# EAGLE design OpenSnake (EAGLE 9.6.2)
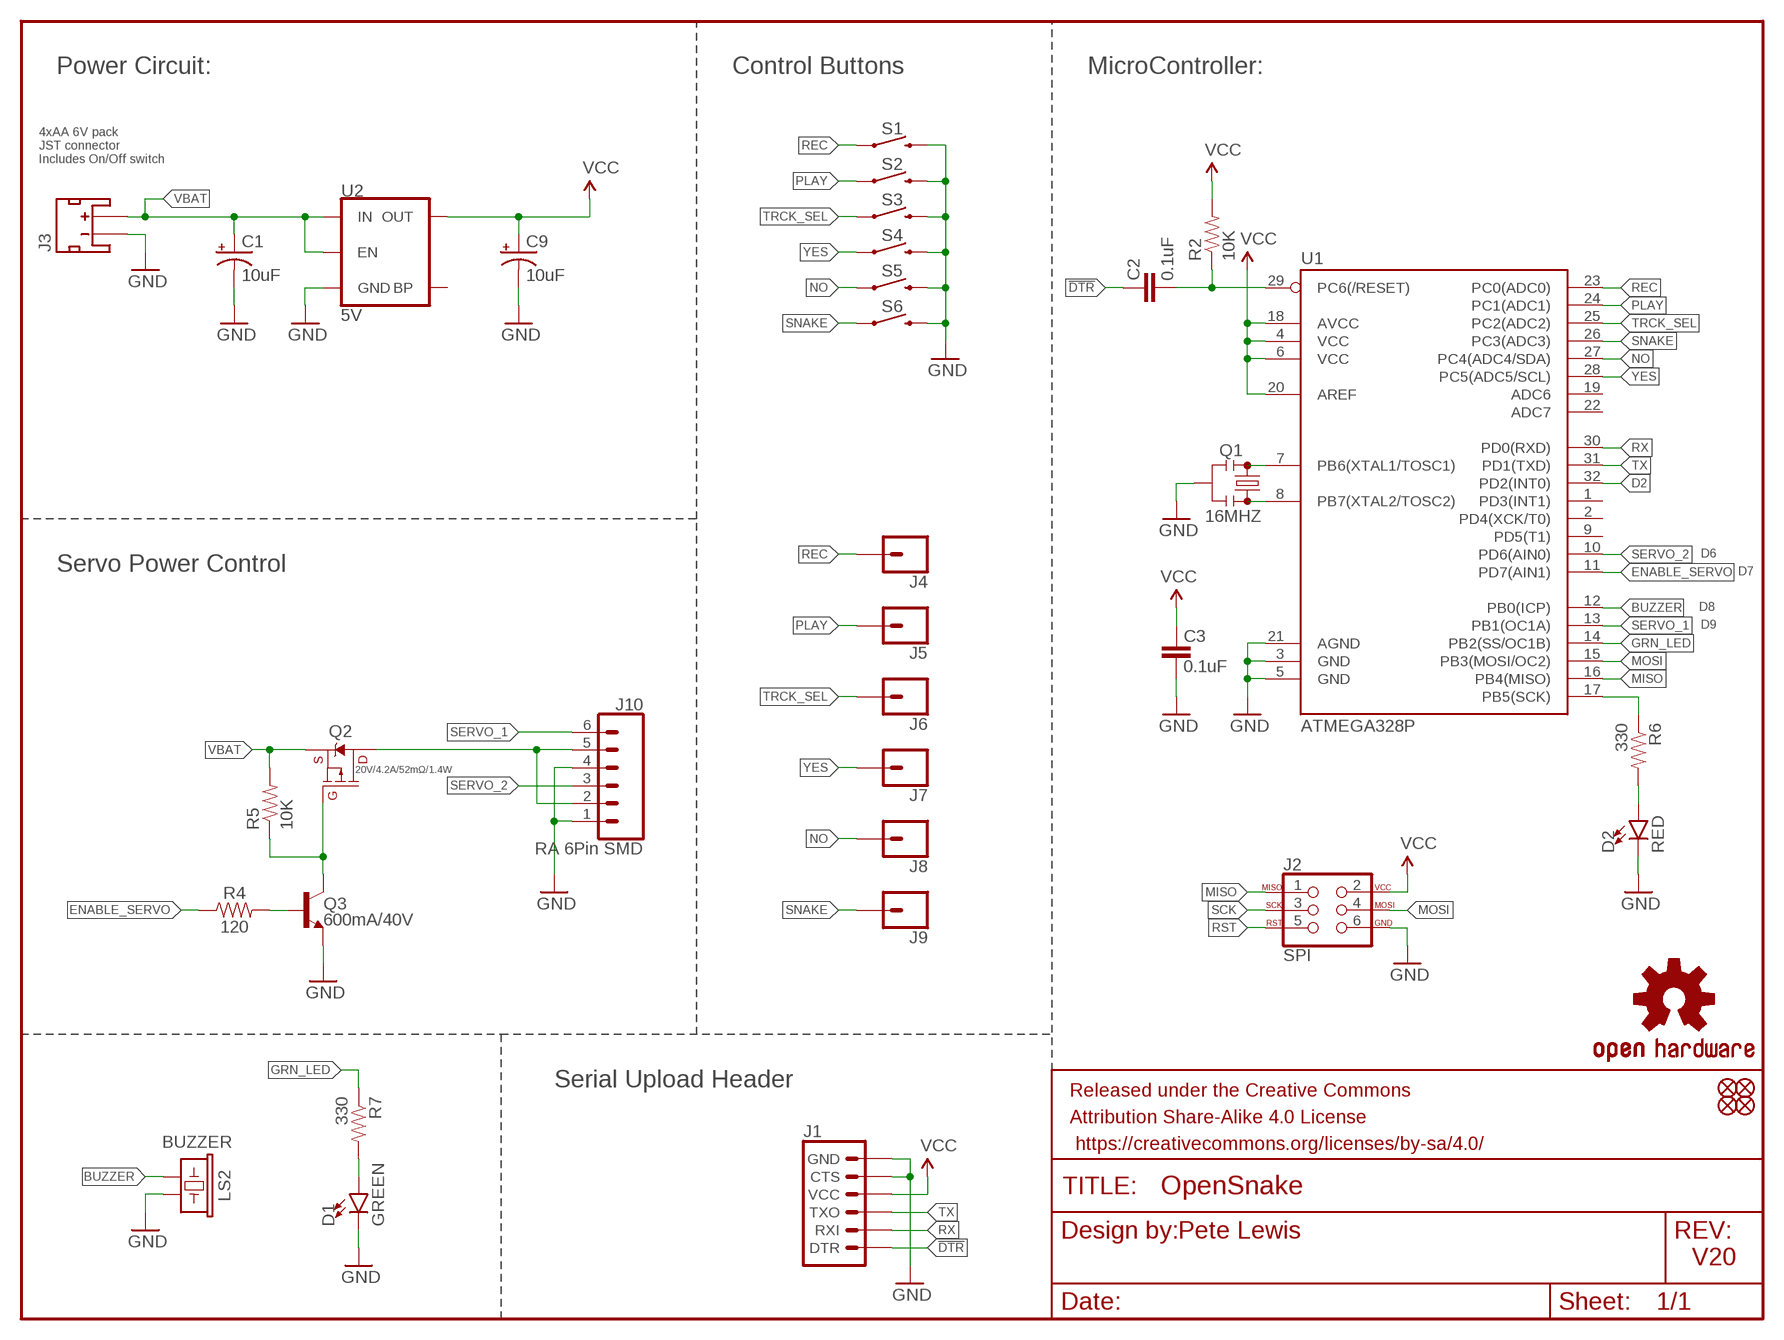
[diagram p0: schematic, sheet 1]

## Parts
C1  10uF  10UF-POLAR-EIA3216-16V-10%(TANT)  [EIA3216]
C2  0.1uF  0.1UF-25V(+80/-20%)(0603)  [0603-CAP]
C3  0.1uF  0.1UF-25V(+80/-20%)(0603)  [0603-CAP]
C9  10uF  10UF-POLAR-EIA3216-16V-10%(TANT)  [EIA3216]
D1  GREEN  LED-GREEN1206  [LED-1206]
D2  RED  LED-RED1206  [LED-1206]
FD1  FIDUCIALUFIDUCIAL  [FIDUCIAL-MICRO]
FD2  FIDUCIALUFIDUCIAL  [FIDUCIAL-MICRO]
FD3  FIDUCIALUFIDUCIAL  [FIDUCIAL-MICRO]
FD4  FIDUCIALUFIDUCIAL  [FIDUCIAL-MICRO]
FRAME1  FRAME-LETTER  [CREATIVE_COMMONS]
J1  6_PIN_SERIAL_TARGETSILK  [6_PIN_SERIAL_TARGET_SIDE_W_SILK]
J2  SPI  AVR_SPI_PROG_3X2TESTPOINTS  [2X3_TEST_POINTS]
J3  JST_2MM_MALE  [JST-2-SMD]
J4  CONN_01PTH_NO_SILK_YES_STOP  [1X01_NO_SILK]
J5  CONN_01PTH_NO_SILK_YES_STOP  [1X01_NO_SILK]
J6  CONN_01PTH_NO_SILK_YES_STOP  [1X01_NO_SILK]
J7  CONN_01PTH_NO_SILK_YES_STOP  [1X01_NO_SILK]
J8  CONN_01PTH_NO_SILK_YES_STOP  [1X01_NO_SILK]
J9  CONN_01PTH_NO_SILK_YES_STOP  [1X01_NO_SILK]
J10  RA 6Pin SMD  CONN_06SMD  [1X06-SMD_RA_MALE]
LOGO1  OSHW-LOGOL  [OSHW-LOGO-L]
LS2  BUZZER  BUZZER-SMD  [BUZZER-CCV]
Q1  16MHZ  RESONATOR16MHZ  [RESONATOR-SMD]
Q2  20V/4.2A/52mΩ/1.4W  MOSFET_PCH-DMG2305UX-7  [SOT23-3]
Q3  600mA/40V  TRANS_NPN-MMBT2222AL  [SOT23-3]
R2  10K  10KOHM-1/10W-1%(0603)0603  [0603-RES]
R4  120  100OHM-0603-1/10W-1%  [0603]
R5  10K  10KOHM-1/10W-1%(0603)0603  [0603-RES]
R6  330  330OHM1/10W1%(0603)  [0603-RES]
R7  330  330OHM1/10W1%(0603)  [0603-RES]
S1  MOMENTARY-SWITCH-SPST-SMD-5.2MM-TALL  [TACTILE_SWITCH_SMD_5.2MM]
S2  MOMENTARY-SWITCH-SPST-SMD-5.2MM-TALL  [TACTILE_SWITCH_SMD_5.2MM]
S3  MOMENTARY-SWITCH-SPST-SMD-5.2MM-TALL  [TACTILE_SWITCH_SMD_5.2MM]
S4  MOMENTARY-SWITCH-SPST-SMD-5.2MM-TALL  [TACTILE_SWITCH_SMD_5.2MM]
S5  MOMENTARY-SWITCH-SPST-SMD-5.2MM-TALL  [TACTILE_SWITCH_SMD_5.2MM]
S6  MOMENTARY-SWITCH-SPST-SMD-5.2MM-TALL  [TACTILE_SWITCH_SMD_5.2MM]
U1  ATMEGA328P  ATMEGA328P_TQFP  [TQFP32-08]
U2  5V  V_REG_MIC52055V  [SOT23-5]

## Nets
!DTR: C2.2 J1.P$1(DTR)
BUZZER: LS2.- U1.12(PB0(ICP))
D2: U1.32(PD2(INT0))
ENABLE_SERVO: R4.1 U1.11(PD7(AIN1))
GND [vcc]: C1.- C3.1 C9.- D1.C D2.C J1.P$5(CTS) J1.P$6(GND) J2.6 J3.1(-) J10.1 J10.4 LS2.+ Q1.2 Q3.2(E) S1.3 S2.3 S3.3 S4.3 S5.3 S6.3 U1.3(GND) U1.5(GND) U1.21(AGND) U2.2(GND)
GRN_LED: R7.1 U1.14(PB2(SS/OC1B))
MISO: J2.1 U1.16(PB4(MISO))
MOSI: J2.4 U1.15(PB3(MOSI/OC2))
N$1: Q1.1 U1.8(PB7(XTAL2/TOSC2))
N$2: Q1.3 U1.7(PB6(XTAL1/TOSC1))
N$4: Q3.1(B) R4.2
N$5: Q2.1(G) Q3.3(C) R5.1
N$6: J10.2 J10.5 Q2.3(D)
N$7: D2.A R6.2
N$10: D1.A R7.2
NO: J8.1 S5.1 U1.27(PC4(ADC4/SDA))
PLAY: J5.1 S2.1 U1.24(PC1(ADC1))
REC: J4.1 S1.1 U1.23(PC0(ADC0))
RST: C2.1 J2.5 R2.1 U1.29(PC6(/RESET))
RX: J1.P$3(RXI) U1.30(PD0(RXD))
SCK: J2.3 R6.1 U1.17(PB5(SCK))
SERVO_1: J10.6 U1.13(PB1(OC1A))
SERVO_2: J10.3 U1.10(PD6(AIN0))
SNAKE: J9.1 S6.1 U1.26(PC3(ADC3))
TRCK_SEL: J6.1 S3.1 U1.25(PC2(ADC2))
TX: J1.P$2(TXO) U1.31(PD1(TXD))
VBAT: C1.+ J3.2(+) Q2.2(S) R5.2 U2.1(IN) U2.3(EN)
VCC: C3.2 C9.+ J1.P$4(VCC) J2.2 R2.2 U1.4(VCC) U1.6(VCC) U1.18(AVCC) U1.20(AREF) U2.5(OUT)
YES: J7.1 S4.1 U1.28(PC5(ADC5/SCL))
Unconnected: J3.NC1(PAD1) J3.NC2(PAD2) U1.1(PD3(INT1)) U1.2(PD4(XCK/T0)) U1.9(PD5(T1)) U1.19(ADC6) U1.22(ADC7) U2.4(BP)

## Notes on the sheet
- Power Circuit: | Control Buttons | MicroController:
- 4xAA 6V pack
  JST connector
  Includes On/Off switch
- D6
- Servo Power Control
- D7
- D8
- D9
- Serial Upload Header
- Pete Lewis
- V20

## Library data of the parts
C1 C9 = SparkFun-Capacitors:10UF-POLAR: 10.0µF polarized capacitors A capacitor is a passive two-terminal electrical component used to store electrical energy temporarily in an electric field.; PROD_ID: CAP-00811
C2 C3 = SparkFun-Capacitors:0.1UF-25V(+80/-20%)(0603): CAP-00810 Ceramic Standard decoupling cap; PROD_ID: CAP-00810
D1 = SparkFun-LED:LED-GREEN: Green SMD LED Used in manufacturing of various products at SparkFun Packages: 0603 - SMD 0603 package [Product Link] <http://www.futureelectronics.com/en/technologies/semiconductors/optoelectronics/leds/Pages/9894312-LTST-C190GKT.aspx?CrossPart=HSMG-C190&IM=0> LilyPad 1206 - SMD1206 LilyPad package [Product Link] <http://www.futureelectronics.com/en/Technologies/Product.aspx?ProductID=IN150NGHARVATEKCORPORATION2049943&IM=0> 1206 - SMD1206 package [Product Link] <http://www.futureelectronics.com/en/technologies/semiconductors/optoelectronics/leds/Pages/8315665-LTST-C150KGKT.aspx?IM=0> 1206 Bottom Mount -SMD 1206 Bottom Mount [Product Link] <http://www.digikey.com/product-detail/en/lite-on-inc/LTST-C230KGKT/160-1456-1-ND/386854> SparkFun Products: Pro Mini 328 -5V <https://www.sparkfun.com/products/821> RedBoard <https://www.sparkfun.com/products/12757> MP3 Trigger <https://www.sparkfun.com/products/13720> Makey Makey <https://www.sparkfun.com/products/11076>; PROD_ID: DIO-00862
D2 = SparkFun-LED:LED-RED: Red SMD LED Used in manufacturing of most products at SparkFun Packages: 0603 - SMD 0603 package [Product Link] <http://docs.avagotech.com/docs/AV02-0551EN> 0603 SMART - SMD 0603 SMART package ( more efficient and expensive)[Product Link] <http://www.osram-os.com/Graphics/XPic2/00077099_0.pdf> 1206 - SMD1206 package [Product Link] <https://www.sparkfun.com/datasheets/DevTools/LilyPad/Q150OVS4.pdff> SparkFun Products: Pro Mini 328 -5V <https://www.sparkfun.com/products/821> RedBoard <https://www.sparkfun.com/products/12757> IOIO-OTG <https://www.sparkfun.com/products/13613>; PROD_ID: DIO-09912
FD1-FD4 = SparkFun-Aesthetics:FIDUCIAL: Fiducial Alignment Points Point-of-reference for pick-and-place machines and other optical instruments.
FRAME1 = SparkFun-Aesthetics:FRAME-LETTER: Schematic Frame - Letter Standard 8.5x11 US Letter frame
J1 = SparkFun-Connectors:6_PIN_SERIAL_TARGET: 6-pin header connection for use with the "FTDI BASIC" pinout - TARGET SIDE. Also known as "Arduino Serial Program Header". It is used to mate with our FTDI Basic serial programmers using the Arduino IDE. Note, this device has "TARGET" in the name. It is intended to be used on a design that contains a target micro-controller that you wish to program. The "sister" device, named "CABLE" is inteneded to be used on a design that usually lives on the end of your USB cable and prvides the converter chip (FTDI232 or FTDI231x) to commnicate serial RX/TX. You can populate with some of these: Break Away Headers - Straight <https://www.sparkfun.com/products/116> (PRT-00116) For reference (or to suit your programming needs) check out these designs: SparkFun FTDI Basic Breakout - 5V <https://www.sparkfun.com/products/9716> (DEV-09716) SparkFun FTDI Basic Breakout - 3.3V <https://www.sparkfun.com/products/9873> (DEV-09873) SparkFun FTDI SmartBasic <https://www.sparkfun.com/products/12935> (DEV-12935) SparkFun Beefy 3 - FTDI Basic Breakout <https://www.sparkfun.com/products/13746> (DEV-13746)
J2 = SparkFun-Connectors:AVR_SPI_PROG_3X2: AVR ISP 6 Pin This is the reduced ISP connector for AVR programming. Common on Arduino. This footprint will take up less PCB space and can be used with a 10-pin to 6-pin adapter such as SKU: BOB-08508 **Special note about "TEST_POINT" package. The stop mask is on the top side, so if you want your programming test points to be on the bottom of your board, make sure to place this package on the bottom side of the board. This also ensure that the orientation to program from the bottom side will be correct. SparkFun Products: SparkFun ISP Pogo Adapter <https://www.sparkfun.com/products/11591> - NS Tiny AVR Programmer <https://www.sparkfun.com/products/11801> -PTH
J3 = SparkFun-Connectors:JST_2MM_MALE: JST 2MM MALE RA CONNECTOR Two pin, compact surface mount connector. Commonly used as a battery input connection point. We really like the solid locking feeling and high current rating on these small connectors. We use these all the time as battery connectors. Mates to single-cell LiPo batteries. Here is the connector we sell at SparkFun: JST Right Angle Connector - White <https://www.sparkfun.com/products/8612> (PRT-08612) Datasheet <http://www.sparkfun.com/datasheets/Prototyping/Connectors/JST-Horizontal.pdf> It was used on these SparkFun products: SparkFun MOSFET Power Controller <https://www.sparkfun.com/products/11214> (PRT-11214) SparkFun Battery Babysitter - LiPo Battery Manager <https://www.sparkfun.com/products/13777> (PRT-13777) And many, many others that required a lipo battery connection.; PROD_ID: CONN-11443; SF_ID: PRT-08612
J4-J9 = SparkFun-Connectors:CONN_01: Single connection point. Often used as Generic Header-pin footprint for 0.1 inch spaced/style header connections On any of the 0.1 inch spaced packages, you can populate with these: Break Away Headers - Straight <https://www.sparkfun.com/products/116> (PRT-00116) Break Away Male Headers - Right Angle <https://www.sparkfun.com/products/553> (PRT-00553) Female Headers <https://www.sparkfun.com/products/115> (PRT-00115) Break Away Headers - Machine Pin <https://www.sparkfun.com/products/117> (PRT-00117) Break Away Female Headers - Swiss Machine Pin <https://www.sparkfun.com/products/743> (PRT-00743) This device is also useful as a general connection point to wire up your design to another part of your project. Our various solder wires solder well into these plated through hole pads. Hook-Up Wire - Assortment (Stranded, 22 AWG) <https://www.sparkfun.com/products/11375> (PRT-11375) Hook-Up Wire - Assortment (Solid Core, 22 AWG) <https://www.sparkfun.com/products/11367> (PRT-11367) View the entire wire category on our website here <https://www.sparkfun.com/categories/141> Special notes: SMTSO-256-ET is a "flush mount" nut for a 4-40 screw. We mostly use this on specialty testbeds; it is a nice way to connect hardware to your PCB at an adjustable hieght. Also note, the SNAP packages are for using a snappable style connector. We sell a baggie of snaps and they are also used on two LilyPad designs: Snap Assortment - 30 pack (male and female) <https://www.sparkfun.com/products/11347> (DEV-11347) LilyPad Arduino SimpleSnap <https://www.sparkfun.com/products/10941> (DEV-10941) LilyPad SimpleSnap Protoboard <https://www.sparkfun.com/products/10940> (DEV-10940)
J10 = SparkFun-Connectors:CONN_06: Multi connection point. Often used as Generic Header-pin footprint for 0.1 inch spaced/style header connections On any of the 0.1 inch spaced packages, you can populate with these: Break Away Headers - Straight <https://www.sparkfun.com/products/116> (PRT-00116) Break Away Male Headers - Right Angle <https://www.sparkfun.com/products/553> (PRT-00553) Female Headers <https://www.sparkfun.com/products/115> (PRT-00115) Break Away Headers - Machine Pin <https://www.sparkfun.com/products/117> (PRT-00117) Break Away Female Headers - Swiss Machine Pin <https://www.sparkfun.com/products/743> (PRT-00743) Arduino Stackable Header - 6 Pin <https://www.sparkfun.com/products/9280> (PRT-09280) For SCREWTERMINALS and SPRING TERMINALS visit here: Screw Terimnals on SparkFun.com <https://www.sparkfun.com/search/results?term=Screw+Terminals> (5mm/3.5mm/2.54mm spacing) This device is also useful as a general connection point to wire up your design to another part of your project. Our various solder wires solder well into these plated through hole pads. Hook-Up Wire - Assortment (Stranded, 22 AWG) <https://www.sparkfun.com/products/11375> (PRT-11375) Hook-Up Wire - Assortment (Solid Core, 22 AWG) <https://www.sparkfun.com/products/11367> (PRT-11367) View the entire wire category on our website here <https://www.sparkfun.com/categories/141>; PROD_ID: CONN-08971
LOGO1 = SparkFun-Aesthetics:OSHW-LOGO: Open-Source Hardware (OSHW) Logo This logo indicates the piece of hardware it is found on incorporates a OSHW license and/or adheres to the definition of open source hardware found here: http://freedomdefined.org/OSHW
LS2 = SparkFun-Electromechanical:BUZZER: Buzzer Small round buzzers that operate around the audible 2kHz range. You can use these as speakers to create simple music or user interfaces. Variant Overview: PTH - Mini Speaker - PC Mount 12mm 2.048kHz <https://www.sparkfun.com/products/7950> PTH_KIT - Mini Speaker - PC Mount 12mm 2.048kHz <https://www.sparkfun.com/products/7950> KIT simplifies soldering by adding stop mask to one side of the pads. PTH_NO_SILK - Mini Speaker - PC Mount 12mm 2.048kHz <https://www.sparkfun.com/products/7950> No silkscreen indicator of buzzer outline. PTH_KIT_NO_SILK - Mini Speaker - PC Mount 12mm 2.048kHz <https://www.sparkfun.com/products/7950> KIT package w/o silkscreen SMD - Buzzer Audio Magnetic (CCV-084B16) SMD buzzer used on, e.g. the LilyPad Buzzer <https://www.sparkfun.com/products/8463> and RFID USB Reader <https://www.sparkfun.com/products/9963>. SMD_KIT - Buzzer Audio Magnetic (CCV-084B16) SMD Buzzer with elongated pins to make soldering easier. Used on the SparkFun Simon Says - Surface Mount Soldering Kit <https://www.sparkfun.com/products/10935>.; PROD_ID: COMP-08568
Q1 = SparkFun-FreqCtrl:RESONATOR: Resonator Small SMD resonator. Used, eg, on the Arduino Pro/ Pro Mini boards. 8MHz- XTAL-08895 16MHz- XTAL-08900; PROD_ID: XTAL-08900
Q2 = SparkFun-DiscreteSemi:MOSFET_PCH: P-channel MOSFETs Voltage controlled devices that allow control of high current outputs. SparkFun Products: SparkFun ESP32 Thing <https://www.sparkfun.com/products/13907> SparkFun ESP8266 Thing <https://www.sparkfun.com/products/13231> SparkFun Pi Servo HAT V2 <https://www.sparkfun.com/products/15316> DMG2305UX-7 (20V/4.2A/SOT23-3); PROD_ID: TRAN-14388
Q3 = SparkFun-DiscreteSemi:TRANS_NPN: NPN transistor Current controlled devices typically used to amplify current or used as a switch. BC547 - COM-08928 <http://www.sparkfun.com/products/8928> (TO-92 45V 100mA) (1.Collector 2.Base 3.Emitter) 2N3904 - COM-00521 <http://www.sparkfun.com/products/521> (TO-92 40V 200mA) (1.Emitter 2.Base 3.Collector) P2N2222A - COM-12852 <http://www.sparkfun.com/products/12852> (TO-92 40V 600mA) (1.Collector 2.Base 3.Emitter); PROD_ID: TRANS-08049
R2 R5 = SparkFun-Resistors:10KOHM-1/10W-1%(0603): RES-00824; PROD_ID: RES-00824
R4 = SparkFun-Resistors:100OHM: 100Ω resistor A resistor is a passive two-terminal electrical component that implements electrical resistance as a circuit element. Resistors act to reduce current flow, and, at the same time, act to lower voltage levels within circuits. - Wikipedia; PROD_ID: RES-07863; VALUE: 100
R6 R7 = SparkFun-Resistors:330OHM1/10W1%(0603): RES-00818; PROD_ID: RES-00818
S1-S6 = SparkFun-Switches:MOMENTARY-SWITCH-SPST: Momentary Switch (Pushbutton) - SPST Normally-open (NO) SPST momentary switches (buttons, pushbuttons). Variants PTH-12MM - 12mm square, through-hole Momentary Pushbutton Switch - 12mm Square <https://www.sparkfun.com/products/9190> (COM-09190) PTH-6.0MM, PTH-6.0MM-KIT - 6.0mm square, through-hole Mini Pushbutton Switch <https://www.sparkfun.com/products/97> (COM-00097) KIT package intended for soldering kit's - only one side of pads' copper is exposed. PTH-RIGHT-ANGLE-KIT - Right-angle, through-hole Right Angle Tactile Button <https://www.sparkfun.com/products/10791> - Used on SparkFun BigTime Watch Kit <https://www.sparkfun.com/products/11734> SMD-12MM - 12mm square, surface-mount Tactile Button - SMD (12mm) <https://www.sparkfun.com/products/12993> (COM-12993) Used on SparkFun PicoBoard <https://www.sparkfun.com/products/11888> SMD-4.5MM - 4.5mm Square Trackball Switch Used on SparkFun Blackberry Trackballer Breakout <https://www.sparkfun.com/products/13169> SMD-4.6MMX2.8MM - 4.60mm x 2.80mm, surface mount Used on SparkFun SAMD21 Mini Breakout <https://www.sparkfun.com/products/13664> SMD-5.2MM, SMD-5.2-REDUNDANT - 5.2mm square, surface-mount Mini Pushbutton Switch - SMD <https://www.sparkfun.com/products/8720> (COM-08720) Used on Arduino Pro Mini <https://www.sparkfun.com/products/11114> REDUNDANT package connects both switch circuits together SMD-6.0X3.5MM - 6.0 x 3.5mm, surface mount Momentary Reset Switch SMD <https://www.sparkfun.com/products/8229> (COM-08229) SMD-6.2MM-TALL - 6.2mm square, surface mount Tactile Button - SMD (6mm) <https://www.sparkfun.com/products/12992> Used on SparkFun Digital Sandbox <https://www.sparkfun.com/products/12651> SMD-RIGHT-ANGLE - Right-angle, surface mount Used on SparkFun Block for Intel® Edison - Arduino <https://www.sparkfun.com/products/13036>; PROD_ID: SWCH-14139
U1 = SparkFun-DigitalIC:ATMEGA328P_TQFP; PROD_ID: IC-09069; VALUE: ATMEGA328P_TQFP
U2 = SparkFun-IC-Power:V_REG_MIC5205: V_REG MIC5205 Standard 3.3V, 5V, and Adjustable 150mA LDO voltage regulator in SOT-23 layout. Micrel part MIC5205. BP (by-pass) pin is used to lower output noise with 470pF cap, may be left open. On the adjustable version BP is used to set output.; PROD_ID: VREG-00823

## Net classes
1 vcc: width 0.203 mm

## Board
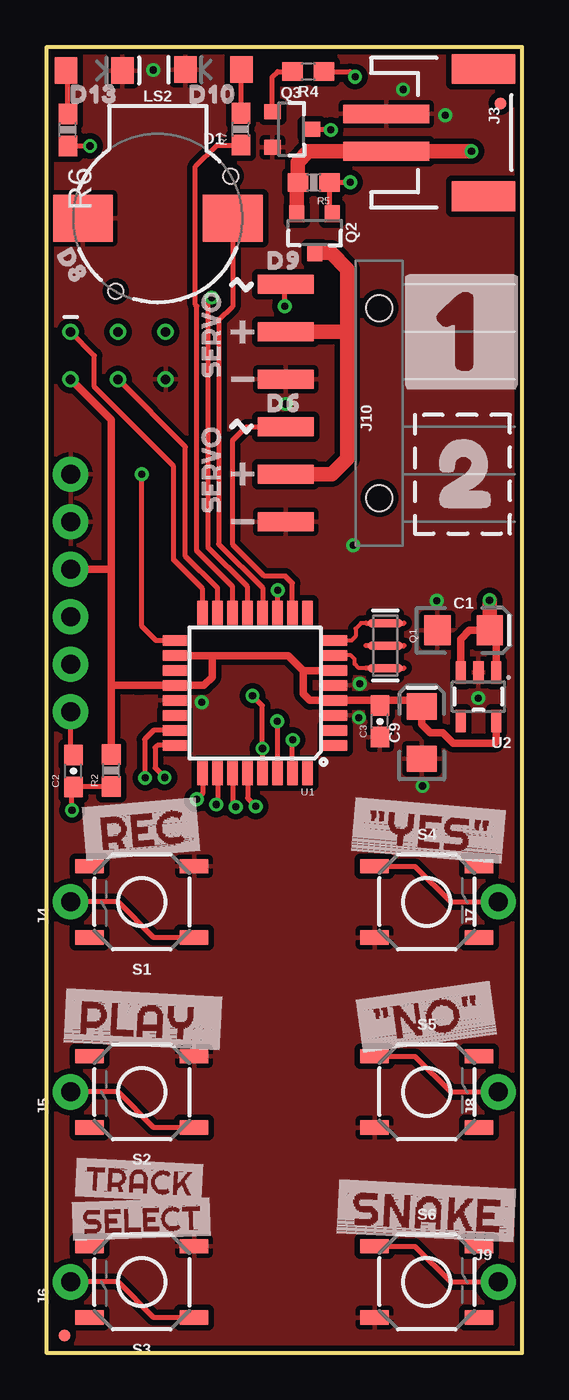
[diagram p1: board, top side]
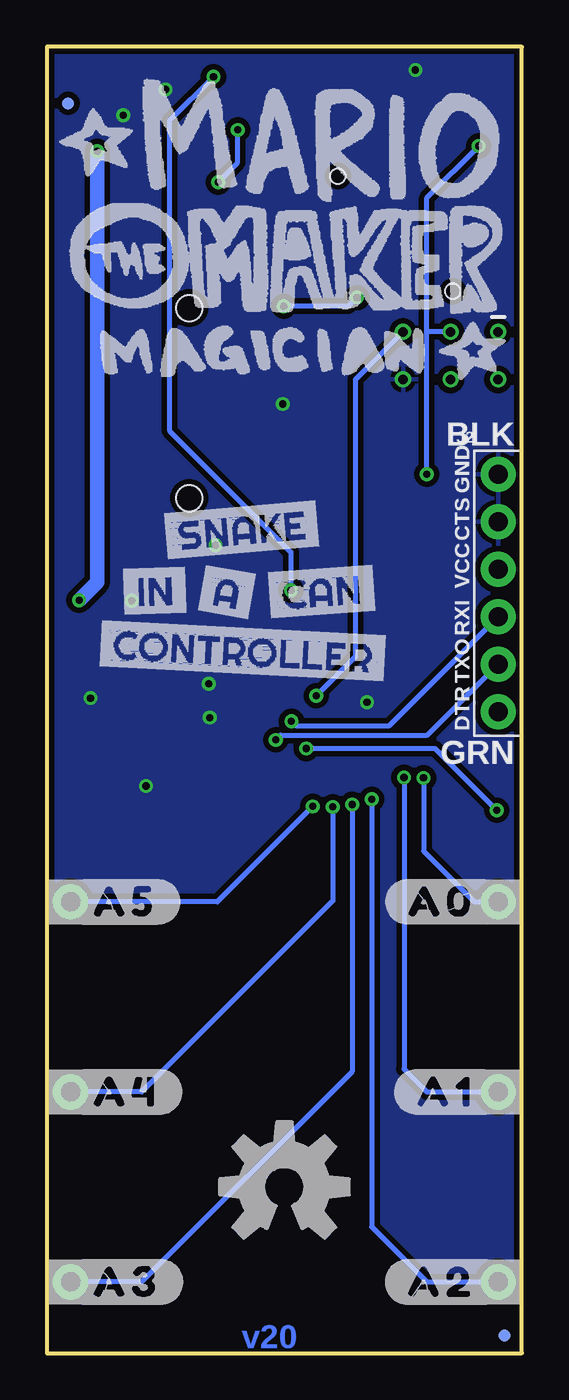
[diagram p2: board, bottom side, seen from below]

Size 25.4 x 69.85 mm. Coordinates in mm from the lower left corner, seen from the top.
Outline: 0,0 0,69.85 25.4,69.85 25.4,0 0,0
Copper layers (1*16): Top 0.035mm / dielectric 1.5mm / Bottom 0.035mm
Design rules "SparkFun-2-layer-TIGHT": minimum track width 7mil, minimum drill 15mil, track to track 7mil, track to pad 7mil, pad to pad 7mil, via to via 7mil, smd to smd 7mil, copper to edge 7mil, drill to drill 7mil, minimum pad ring 7mil, minimum via ring 7mil, stop-mask expansion 4mil, vias tented up to drill 25mil, thermal gap 10mil

### Footprints (pad centres in the part's own frame; a part is rotated, then mirrored left to right if it is on the bottom)
EIA3216 = smd 1.4 x 1.6: + 1.4,0; - -1.4,0
0603-CAP = smd 1.1 x 1: 1 -0.85,0; 2 0.85,0
LED-1206 = smd 1.2 x 1.4: A -1.5,0; C 1.5,0
FIDUCIAL-MICRO = smd 0.635 x 0.635: 1 0,0
6_PIN_SERIAL_TARGET_SIDE_W_SILK = drill 1.016 pad 1.88: P$1 -6.35,0; P$2 -3.81,0; P$3 -1.27,0; P$4 1.27,0; P$5 3.81,0; P$6 6.35,0
2X3_TEST_POINTS = drill 0.508: 1 -2.54,-1.27; 2 -2.54,1.27; 3 0,-1.27; 4 0,1.27; 5 2.54,-1.27; 6 2.54,1.27
JST-2-SMD = smd 1 x 4.6: 1 -1,-3.7; 2 1,-3.7 | smd 1.6 x 3.4: NC1 -3.4,1.5; NC2 3.4,1.5
1X01_NO_SILK = drill 1.016 pad 1.88: 1 0,0
1X06-SMD_RA_MALE = smd 1 x 3: 1 -6.35,5; 2 -3.81,5; 3 -1.27,5; 4 1.27,5; 5 3.81,5; 6 6.35,5 | hole 1.4: -5.08,0; 5.08,0
BUZZER-CCV = smd 3.2 x 2.5: + 4,0; - -4,0 | hole 0.8: -3.9,-2.25; 2.25,3.9
RESONATOR-SMD = smd 0.45 x 1.905: 1 -1.2,0; 2 0,0; 3 1.2,0
SOT23-3 = smd 0.8 x 0.9: 1 -0.95,-1; 2 0.95,-1; 3 0,1.1
0603-RES = smd 1.1 x 1: 1 -0.85,0; 2 0.85,0
0603 = smd 1.1 x 1: 1 -0.85,0; 2 0.85,0
TACTILE_SWITCH_SMD_5.2MM = smd 1.524 x 0.762: 1 -2.794,1.905; 2 2.794,1.905; 3 -2.794,-1.905; 4 2.794,-1.905
TQFP32-08 = smd 1.27 x 0.559: 1 -4.293,2.8; 2 -4.293,2; 3 -4.293,1.2; 4 -4.293,0.4; 5 -4.293,-0.4; 6 -4.293,-1.2; 7 -4.293,-2; 8 -4.293,-2.8; 17 4.293,-2.8; 18 4.293,-2; 19 4.293,-1.2; 20 4.293,-0.4; 21 4.293,0.4; 22 4.293,1.2; 23 4.293,2; 24 4.293,2.8 | smd 0.559 x 1.27: 9 -2.8,-4.293; 10 -2,-4.293; 11 -1.2,-4.293; 12 -0.4,-4.293; 13 0.4,-4.293; 14 1.2,-4.293; 15 2,-4.293; 16 2.8,-4.293; 25 2.8,4.293; 26 2,4.293; 27 1.2,4.293; 28 0.4,4.293; 29 -0.4,4.293; 30 -1.2,4.293; 31 -2,4.293; 32 -2.8,4.293
SOT23-5 = smd 0.55 x 1.2: 1 -0.95,-1.3; 2 0,-1.3; 3 0.95,-1.3; 4 0.95,1.3; 5 -0.95,1.3

### Placement (x,y rotation side)
C1  22.29,38.65 0 top
C2  1.42,31.13 90 top
C3  17.81,33.79 90 top
C9  20.05,33.18 90 top
D1  8.92,68.63 180 top
D2  2.54,68.58 0 top
FD1  24.26,66.83 0 top
FD2  24.26,66.83 0 bottom
FD3  0.94,0.94 0 top
FD4  0.94,0.94 0 bottom
FRAME1  -21.06,-15.24 0 top  (outside the outline)
J1  1.27,40.64 90 bottom
J2  3.81,53.34 180 bottom
J3  21.84,65.26 270 top
J4  1.27,24.13 90 top
J5  1.27,13.97 90 top
J6  1.27,3.81 90 top
J7  24.13,24.13 90 top
J8  24.13,13.97 90 top
J9  24.13,3.81 0 top
J10  17.78,50.8 90 top
LOGO1  12.7,8.89 0 bottom
LS2  5.94,60.68 180 top
Q1  18.09,37.83 270 top
Q2  14.32,59.93 180 top
Q3  13.07,65.44 270 top
R2  3.44,31.16 90 top
R4  13.98,68.52 180 top
R5  14.27,62.59 180 top
R6  1.13,65.4 90 top
R7  10.39,65.45 90 top
S1  5.08,24.13 180 top
S2  5.08,13.97 180 top
S3  5.08,3.81 180 top
S4  20.32,24.13 0 top
S5  20.32,13.97 0 top
S6  20.32,3.81 0 top
U1  11.14,35.3 180 top
U2  23.08,35.11 180 top
U$1  [#A0#0]  1.27,24.13 0 bottom
U$2  [#YES#0]  15.56,28.38 355 top
U$3  [#NO#1]  15.89,17.36 8 top
U$4  [SNAKE2]  14.74,7.9 357 top
U$5  [MARIO_LOGO]  25.4,51.05 0 bottom
U$6  [#A1#0]  1.27,13.97 0 bottom
U$7  [#A2#0]  1.27,3.81 0 bottom
U$8  [SERVO2]  8.75,51.22 90 top
U$9  [#A3#0]  24.13,3.81 0 bottom
U$10  [#A4#0]  24.13,13.97 0 bottom
U$11  [#1]  8.45,54.8 0 top
U$12  [#1]  8.45,47.23 0 top
U$13  [SERVO2]  8.76,44 90 top
U$14  [SNAKE0]  19.74,43.61 5 bottom
U$15  [CONTROLLER4]  23.22,37.99 357 bottom
U$16  [IN1]  22,40.69 2 bottom
U$17  [#A5#0]  24.13,24.13 0 bottom
U$18  [D90]  12.7,58.42 0 top
U$19  [REC0]  1.17,27.69 5 top
U$20  [PLAY_1]  0.08,18.11 357 top
U$21  [TRACK2]  0.97,9.45 357 top
U$22  [SELECT3]  0.73,7.02 2 top
U$23  [A2]  17.81,41.05 350 bottom
U$24  [CAN3]  14.5,40.46 4 bottom
U$25  [D60]  12.7,50.8 0 top
U$26  [D100]  8.89,67.31 0 top
U$27  [D130]  2.54,67.31 0 top
U$28  [D80]  1.38,58.12 300 top
U$29  [#1#0]  17.65,54.61 0 top
U$31  [2_0]  23.24,46.99 0 top

### Tracks (layer width: path | path; a pad name or v marks a point on that pad's centre or on a via)
!DTR
  Top 0.254: C2.2 1.27,32.14 J1.P$1
BUZZER
  Top 0.254: U1.12 11.54,40.91 9.2,43.26 9.2,55.22 9.94,55.96 LS2.-
ENABLE_SERVO  (via drill 0.38)
  Top 0.254: R4.1 16.21,68.52 v16.48,68.25 | U1.11 v12.34,40.79
  Bottom 0.254: v16.48,68.25 18.85,65.89 18.85,49.33 12.34,42.82 v12.34,40.79
GND  (via drill 0.38)
  other vias: 16.69,33.99 16.74,35.79 20.85,40.23 20.09,30.33 21.31,66.19 19.05,67.56 5.69,68.61 16.38,43.21 12.78,50.75 8.28,34.8 23.06,35.03
  pour Top (isolate 0.305): 0,0 0,69.85 25.4,69.85 25.4,0
  pour Bottom (isolate 0.305): 0,0 25.4,0 25.4,69.85 0,69.85
GRN_LED
  Top 0.254: U1.14 9.94,40.99 8.03,42.9 8.03,55.98 7.95,56.06 7.95,63.45 9.1,64.6 R7.1
MISO
  Top 0.254: U1.16 8.34,40.86 6.78,42.42 6.78,47.42 2.54,51.66 2.54,53.34 J2.1
MOSI
  Top 0.254: U1.15 9.14,40.9 7.42,42.62 7.42,48.46 J2.4
N$1
  Top 0.203: Q1.1 16.81,39.03 16.51,38.73 16.51,38.33 16.28,38.1 U1.8
N$2
  Top 0.203: Q1.3 16.68,36.63 16.46,36.85 16.46,37.11 16.26,37.31 15.44,37.31 U1.7
N$4
  Top 0.254: Q3.1 12.07,68.25 12.34,68.52 R4.2
N$5  (via drill 0.38)
  Top 0.254: Q2.1 15.12,61.08 R5.1 16.21,62.59 v16.23,62.61 | v15.19,65.41 14.2,65.41 Q3.3
  Bottom 0.254: v16.23,62.61 15.19,63.65 v15.19,65.41
N$6
  Top 0.762: Q2.3 15.21,58.83 16.08,57.96 16.08,54.61 | J10.2 15.24,46.99 16.08,47.83 16.08,54.61 | J10.5 16.08,54.61
N$7
  Top 0.254: R6.2 1.13,68.49 D2.A
N$10
  Top 0.254: R7.2 10.39,68.6 D1.A
NO  (via drill 0.38)
  Top 0.254: S5.1 19.68,15.88 21.59,13.97 J8.1 | U1.27 9.94,29.38 v10.11,29.21
  Bottom 0.254: v10.11,29.21 10.11,24.18 20.32,13.97 J8.1
PLAY  (via drill 0.38)
  Top 0.254: S2.1 5.71,12.06 3.81,13.97 J5.1 | U1.24 5.91,32.5 5.79,32.38 5.79,31.29 v6.3,30.79
  Bottom 0.254: v6.3,30.79 6.3,15.19 5.08,13.97 J5.1
REC  (via drill 0.38)
  Top 0.254: S1.1 5.71,22.23 3.81,24.13 J4.1 | U1.23 5.72,33.3 5.23,32.82 5.23,30.79 v5.26,30.76
  Bottom 0.254: v5.26,30.76 5.26,26.85 2.54,24.13 J4.1
RST  (via drill 0.38)
  Top 0.254: U1.29 v11.54,32.33 v11.53,32.33 11.53,34.62 v11,35.15 | v1.35,29.03 1.35,30.2 C2.1 1.45,30.31 R2.1
  Bottom 0.254: v11.53,32.33 4.65,32.33 v1.35,29.03 | J2.5 8.89,52.07 8.89,37.26 v11,35.15
RX  (via drill 0.38)
  Top 0.254: U1.30 12.34,33.76 v12.32,33.78
  Bottom 0.254: v12.32,33.78 12.09,33.55 7.09,33.55 J1.P$3
SCK  (via drill 0.38)
  Top 0.254: U1.17 5.84,38.1 5.08,38.86 v5.08,46.99 | v2.31,64.54 1.14,64.54 R6.1
  Bottom 0.254: v2.31,64.54 5.08,61.77 5.08,54.61 | v5.08,46.99 5.08,54.61 | J2.3 5.08,54.61
SERVO_1  (via drill 0.38)
  Top 0.254: U1.13 10.74,40.98 8.61,43.1 8.61,56.24 v8.81,56.44 | v12.72,55.98 12.72,57.09 J10.6
  Bottom 0.254: v8.81,56.44 9.27,55.98 v12.72,55.98
SERVO_2
  Top 0.254: U1.10 13.14,41.17 12.75,41.55 11.63,41.55 9.96,43.23 9.96,48.82 10.67,49.53 J10.3
SNAKE  (via drill 0.38)
  Top 0.254: S6.1 19.68,5.71 21.59,3.81 J9.1 | U1.26 9.14,29.41 v9.07,29.34
  Bottom 0.254: v9.07,29.34 9.07,15.06 20.32,3.81 J9.1
TRCK_SEL  (via drill 0.38)
  Top 0.254: S3.1 5.71,1.91 3.81,3.81 J6.1 | U1.25 8.34,29.93 v8.03,29.62
  Bottom 0.254: v8.03,29.62 8.03,6.76 5.08,3.81 J6.1
TX  (via drill 0.38)
  Top 0.254: U1.31 13.14,32.77 v13.16,32.79
  Bottom 0.254: v13.16,32.79 12.9,33.05 5.05,33.05 J1.P$2
VBAT  (via drill 0.38)
  Top 0.406: U2.1 24.03,38.31 C1.+ 22.6,38.65 22.13,38.18 U2.3
  Top 0.762: Q2.2 13.37,62.54 R5.2 13.41,62.6 13.41,63.68 13.99,64.26 J3.2 v22.71,64.26 | C1.+ 23.69,40.24 v23.67,40.26
  Bottom 0.762: v22.71,64.26 22.71,41.22 v23.67,40.26
VCC
  Top 0.406: U2.5 24.03,32.69 23.95,32.61 21.74,32.61 21.18,33.17 20.5,33.17 20.05,33.62 C9.+ 19.73,34.9 18.07,34.9 | C3.2 18.07,34.9 | 18.07,34.9 U1.4 14.07,34.9 13.72,35.26 13.72,36.5 U1.6 13.71,36.5 12.91,37.3 8.81,37.3 | U1.18 8.81,37.3 | 8.81,37.3 8.84,37.27 8.84,36.5 8.84,36.14 8.4,35.7 U1.20 5.08,35.7 4.79,35.7 3.46,35.7 3.44,35.71 | R2.2 3.44,35.71 | 3.44,35.71 3.44,41.91 | 3.44,41.91 3.44,49.9 J2.2 | J1.P$4 3.44,41.91
YES  (via drill 0.38)
  Top 0.254: S4.1 19.68,26.04 21.59,24.13 J7.1 | U1.28 10.74,29.67 v11.18,29.23
  Bottom 0.254: v11.18,29.23 16.28,24.13 J7.1

### Text on the board
Bottom: v20
tValues: RED | NPN | PCH-DMG2305
Reference: HINGE | servo | cable to 6V Battery / (4xAA pack) | cable to servo 1 | cable to servo 2
tDocu: Pete Lewis